# Altium schematic sheet UTHP Edge Connectors.SchDoc: Ultimate Truck Hacking Platform
size Letter; Author: Dr. Jeremy Daily; Organization: Systems Cyber Research Group; Address2: Thomas Balzer; Address3: Carson Green; DocumentNumber: Board Interfaces; Revision: 1; SheetNumber: 3; SheetTotal: 6
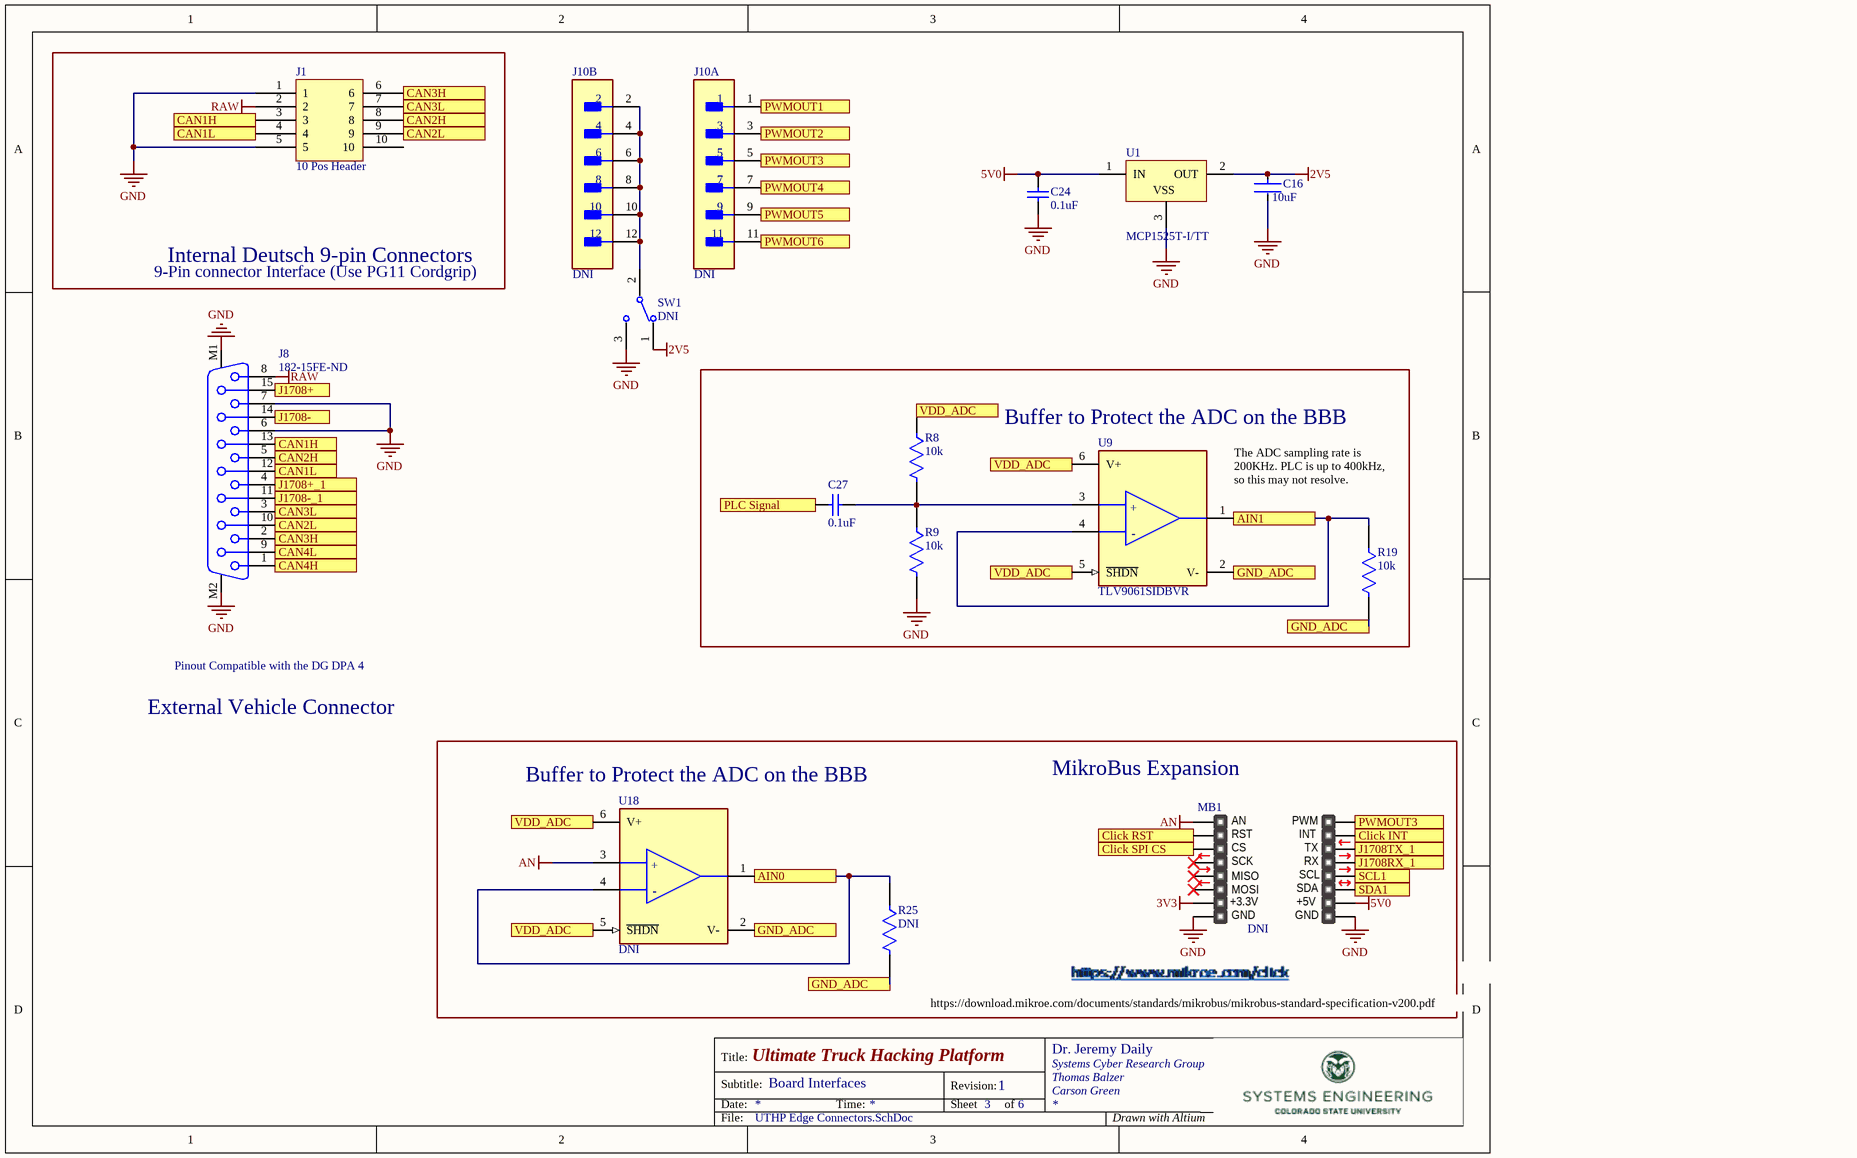
[diagram p0: UTHP Edge Connectors.SchDoc]

## Parts
C16  10uF  [FP-MK325A-MFG]
C24  0.1uF  [CAPC1608X90X35LL15T15]
C27  0.1uF  [CAPC1608X90X35LL15T15]
J1  10 Pos Header  [10 pos Mini-Fit Jr. R/A Header]
J8  182-15FE-ND  [618015231321]
J10  DNI  [FP-70246-1201-0]  (parts A,B of 2)
MB1  DNI  [mikroBUS - Large]  (no BOM)
R8  10k  [FP-KTR03-IPC_B]
R9  10k  [FP-KTR03-IPC_B]
R19  10k  [FP-KTR03-IPC_B]
R25  DNI  [FP-KTR03-IPC_B]
SW1  DNI  [FP-CS12ANW03-MFG]
U1  MCP1525T-I/TT  [SOT-23-TT3_M]
U9  TLV9061SIDBVR  [FP-DBV0006A-MFG]
U18  DNI  [FP-DBV0006A-MFG]

## Blocks framed on the sheet
Internal Deutsch 9-pin Connectors: J1
Buffer to Protect the ADC on the BBB: C27 R8 R9 R19 U9

## Ports
AIN0, AIN1, CAN1H, CAN1L, CAN2H, CAN2L, CAN3H, CAN3L, CAN4H, CAN4L, Click INT, Click RST, Click SPI CS, GND_ADC, J1708+, J1708+_1, J1708-, J1708-_1, J1708RX_1, J1708TX_1, PLC Signal, PWMOUT1, PWMOUT2, PWMOUT3, PWMOUT4, PWMOUT5, PWMOUT6, SCL1, SDA1, VDD_ADC

## Nets
2V5: C16.1 SW1.1 U1.2(OUT)
3V3: MB1.7(3.3V)
5V0: C24.1 MB1.10(5V) U1.1(IN)
AN: MB1.1(AN) U18.3(+IN)
GND: C16.2 C24.2 J1.1 J1.5 J8.6 J8.7 J8.M1 J8.M2 MB1.8(GND) MB1.9(GND) R9.2 SW1.3 U1.3(VSS)
RAW: J1.2 J8.8
AIN0: R25.1 U18.1(OUT) U18.4(-IN) ; port AIN0
AIN1: R19.1 U9.1(OUT) U9.4(-IN) ; port AIN1
CAN1H: J1.3 J8.13 ; port CAN1H
CAN1L: J1.4 J8.12 ; port CAN1L
CAN2H: J1.8 J8.5 ; port CAN2H
CAN2L: J1.9 J8.10 ; port CAN2L
CAN3H: J1.6 J8.2 ; port CAN3H
CAN3L: J1.7 J8.3 ; port CAN3L
CAN4H: J8.1 ; port CAN4H
CAN4L: J8.9 ; port CAN4L
Click INT: MB1.15(INT) ; port Click INT
Click RST: MB1.2(RST) ; port Click RST
Click SPI CS: MB1.3(CS) ; port Click SPI CS
GND_ADC: R19.2 R25.2 U9.2(V-) U18.2(V-) ; port GND_ADC
J1708+: J8.15 ; port J1708+
J1708+_1: J8.4 ; port J1708+_1
J1708-: J8.14 ; port J1708-
J1708-_1: J8.11 ; port J1708-_1
J1708RX_1: MB1.13(TX) ; port J1708RX_1
J1708TX_1: MB1.14(RX) ; port J1708TX_1
PLC Signal: C27.1 ; port PLC Signal
PWMOUT1: J10.1 ; port PWMOUT1
PWMOUT2: J10.3 ; port PWMOUT2
PWMOUT3: J10.5 MB1.16(PWM) ; port PWMOUT3
PWMOUT4: J10.7 ; port PWMOUT4
PWMOUT5: J10.9 ; port PWMOUT5
PWMOUT6: J10.11 ; port PWMOUT6
SCL1: MB1.12(SCL) ; port SCL1
SDA1: MB1.11(SDA) ; port SDA1
VDD_ADC: R8.1 U9.5(~{SHDN}) U9.6(V+) U18.5(~{SHDN}) U18.6(V+) ; port VDD_ADC
NetC27_2: C27.2 R8.2 R9.1 U9.3(+IN)
NetJ10_2: J10.2 J10.4 J10.6 J10.8 J10.10 J10.12 SW1.2(2(COM))

Not connected (* = marked no-connect by the designer): J1 10; MB1 4(SCK)* 5(MISO)* 6(MOSI)*

## Notes on the sheet
- 9-Pin connector Interface (Use PG11 Cordgrip)
- (near U9) The ADC sampling rate is 200KHz. PLC is up to 400kHz, so this may not resolve.
- Pinout Compatible with the DG DPA 4
- External Vehicle Connector
- (near MB1) MikroBus Expansion
- (near U18) Buffer to Protect the ADC on the BBB
- https://download.mikroe.com/documents/standards/mikrobus/mikrobus-standard-specification-v200.pdf
- Title:
- Subtitle:
- Date:
- Time:
- Revision:
- Sheet
- of
- File:
- Drawn with Altium
- (in symbol CMP-068-000000-1) +3.3V; +5V
- (in symbol CMP-04895-000376-1) +; -

## Library data of the parts
C16 = CMP-14477-002214-1: CAP CER 10UF 50V X7R 1210 UMK325AB7106KM-T; Manufacturer: Taiyo Yuden; Part Number: UMK325AB7106KM-T; Supplier 1: Digi-Key; Supplier Part Number 1: 587-3167-1-ND
C24 C27 = CMP-2006-04387-1: 0.1 µF ±10% 50V Ceramic Capacitor X7R 0603 (1608 Metric); Manufacturer: KYOCERA AVX; Part Number: KAM15AR71H104KM; Supplier 1: Digi-Key; Supplier Part Number 1: 478-KAM15AR71H104KMTR-ND; Value: 0.1uF
J1 = CMP-025-000000-1: Connector Header Through Hole, Right Angle 10 position 0.165" (4.20mm); Manufacturer: Molex; Value: Molex 10-pos; Part Number: 39-30-1100; Supplier 1: Digi-Key; Supplier Part Number 1: WM1355-ND
J8 = CMP-1502-00205-2: NorComp Inc. Part #: 182-015-213R531 / Digikey Part #: 182-15FE-ND / Link: https://www.digikey.com/en/products/detail/norcomp-inc/182-015-213R531/858357; NexarPartId: 22865747; Insulation Resistance: 5GΩ; Number of Contacts: 15; Pitch: 2.77mm; Current Rating: 3A; Contact Resistance: 30mΩ; Gender: Female; Operating Supply Voltage: 125V; Number of Rows: 2; Number of Pins: 15; Termination: SMD/SMT; Depth: 20.75mm; Orientation: Right Angle; Contact Plating: Gold; Width: 12.5mm; RoHS: Compliant; REACH SVHC: Unknown; Max Operating Temperature: 105°C; Housing Material: Steel; Min Operating Temperature: -55°C; Voltage Rating: 125V; Insulation Material: PBT; Mount: Through Hole; Length: 24.76mm
J10 = CMP-00257-00249961-1: 70246-1201 Conn Shrouded Header (4 Sides) HDR 12 POS 2.54mm Solder ST Top Entry Thru-Hole C-Grid® Tray; NexarPartId: 249961; Connector Type: Male Pin; Max Voltage Rating (DC): 250V; Gender: Male; Number of Contacts: 12; Current Rating: 2.5A; Glow Wire Compliant: Non-compliant; Max Operating Temperature: 120°C; ELV: Compliant; Contact Plating: Gold; Orientation: Vertical; Height: 9.47mm; Pitch: 2.54mm; Lead Free: Lead Free; Length: 22.86mm; Contact Mating Length: 6.096mm; Voltage Rating: 250V; RoHS: Compliant; REACH SVHC: No SVHC; Color: Black; Min Operating Temperature: -55°C; Termination: Solder; Housing Color: Black; Depth: 8.89mm; Flammability Rating: UL94 V-0; Number of Rows: 2; Row Spacing: 2.54mm; Housing Material: Polyester; Number of Positions: 12; Contact Material: Bronze, Gold, Nickel; Mount: Through Hole; Number of Circuits: 12
MB1 = CMP-068-000000-1: mikroBUS compatible add-on board
R8 R9 R19 = CMP-08839-030382-1: 10 kOhms ±1% 0.1W, 1/10W Chip Resistor 0603 (1608 Metric) Automotive AEC-Q200, High Voltage Thick Film; Manufacturer: Rohm Semiconductor; Part Number: KTR03EZPF1002; Supplier 1: Digi-Key; Supplier Part Number 1: RHM10.0KAYCT-ND; Value: 10k
R25 = CMP-08839-030382-1: 10 kOhms ±1% 0.1W, 1/10W Chip Resistor 0603 (1608 Metric) Automotive AEC-Q200, High Voltage Thick Film; Manufacturer: Rohm Semiconductor; Part Number: KTR03EZPF1002; Value: 10k; Supplier 1: Digi-Key; Supplier Part Number 1: RHM10.0KAYCT-ND
SW1 = CMP-31746-000002-1: SWITCH SLIDE SPDT 3A 125V; Max Voltage Rating (AC): 250V; Mechanical Life: 50000Cycles; Switch Travel: 2.2mm; Electrical Life: 20000Cycles; Actuator Length: 5.1mm; Illumination Type: Non-Illuminated; Contact Style: Non-Shorting; Actuator Type: Standard; Actuator Material: Nylon; Switch Function: On-On; Max Operating Temperature: 85°C; Series: CS; Contact Current Rating: 3A; Min Operating Temperature: -30°C; Current Rating: 3A; Mount: Through Hole; Depth: 7.5mm; RoHS Compliant: Yes; Throw Configuration: SPDT; Lead Free: Lead Free; Orientation: Vertical; Contact Plating: Silver; Reach SVHC Compliant: Yes; Termination: PC Pin; Max Current Rating: 3A; Packaging: Tray; Length: 14mm; Package Quantity: 1; Primary Type: SWITCH; Flammability Rating: UL94 V-0; Contact Material: Copper; Voltage Rating (AC): 125V
U1 = CMP-0131-00003-1: 2.5V Voltage Reference, 3-Pin SOT-23, Industrial Temperature, Tape and Reel; DatasheetVersion: revB, Feb-2005; Code_IPC: SOT23-3; PackageDescription: 3-Lead Plastic Small Outline Transistor (TT) [SOT-23]; PackageReference: SOT-23-TT3; PackageVersion: revBB, Aug-2009
U9 U18 = CMP-04895-000376-1: IC CMOS 1 CIRCUIT SOT23-6; RoHS Compliant: Yes